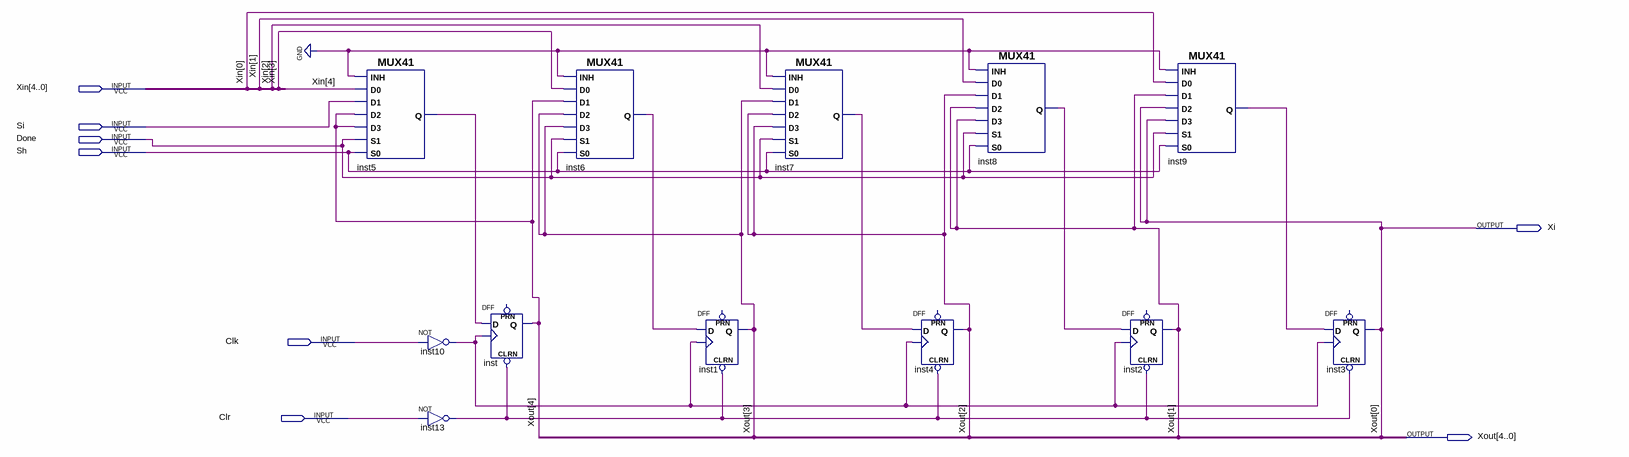
[diagram p0: schematic sheet]
// Quartus schematic X_Accumulator.bdf as structural Verilog: 12 symbols, 8 pins
module X_Accumulator (
  input  [4:0] Xin,
  input  Si,
  input  Done,
  input  Sh,
  input  Clk,
  input  Clr,
  output Xi,
  output [4:0] Xout
);

  wire inst5_q, inst6_q, inst7_q, inst8_q, inst9_q, inst10_out, inst13_out;

  MUX41 inst5 (.S0(Sh), .D2(Xout[4]), .S1(Done), .D3(Xout[4]), .D0(Xin[4]), .INH(1'b0), .D1(Si), .Q(inst5_q));
  not inst10 (inst10_out, Clk);
  not inst13 (inst13_out, Clr);
  DFF inst (.CLRN(inst13_out), .CLK(inst10_out), .D(inst5_q), .Q(Xout[4]));  // open: PRN
  MUX41 inst6 (.S0(Sh), .D2(Xout[3]), .S1(Done), .D3(Xout[3]), .D0(Xin[3]), .INH(1'b0), .D1(Xout[4]), .Q(inst6_q));
  DFF inst1 (.CLRN(inst13_out), .CLK(inst10_out), .D(inst6_q), .Q(Xout[3]));  // open: PRN
  MUX41 inst7 (.S0(Sh), .D2(Xout[2]), .S1(Done), .D3(Xout[2]), .D0(Xin[2]), .INH(1'b0), .D1(Xout[3]), .Q(inst7_q));
  DFF inst4 (.CLRN(inst13_out), .CLK(inst10_out), .D(inst7_q), .Q(Xout[2]));  // open: PRN
  MUX41 inst8 (.S0(Sh), .D2(Xout[1]), .S1(Done), .D3(Xout[1]), .D0(Xin[1]), .INH(1'b0), .D1(Xout[2]), .Q(inst8_q));
  DFF inst2 (.CLRN(inst13_out), .CLK(inst10_out), .D(inst8_q), .Q(Xout[1]));  // open: PRN
  MUX41 inst9 (.S0(Sh), .D2(Xi), .S1(Done), .D3(Xi), .D0(Xin[0]), .INH(1'b0), .D1(Xout[1]), .Q(inst9_q));
  DFF inst3 (.CLRN(inst13_out), .CLK(inst10_out), .D(inst9_q), .Q(Xi));  // open: PRN

  assign Xout[0] = Xi;
endmodule
